# Altium project New PCB Design.PrjPcb
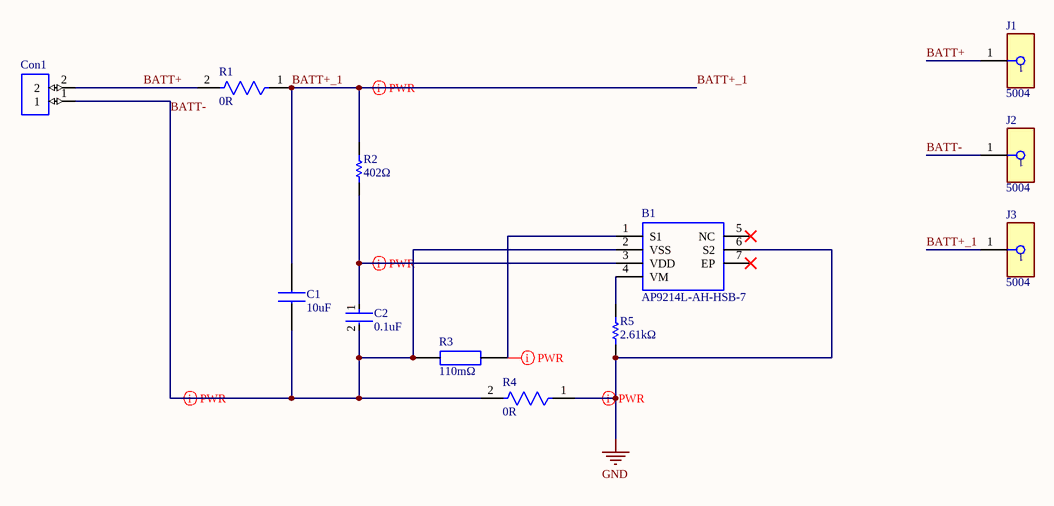
[diagram p0: Battery_Prtection.SchDoc]
3 sheets, 36 parts. Net scope: global (net labels, ports and power ports of the same name join across sheets).
Board file: New PCB Design.PcbDoc
Sheets:
  Battery_Prtection.SchDoc
  Battery_Charger.SchDoc
  Battery_Monitor.SchDoc

## Sheet Battery_Prtection.SchDoc: Battery Protection
size A4; CompanyName: TechLabs Global Pvt Ltd; Organization: TechLabs Global Pvt Ltd; DocumentNumber: 1; Revision: 1.0; SheetNumber: 1; SheetTotal: 3

### Parts
B1  AP9214L-AH-HSB-7  [AP9214LAHHSB7]
C1  10uF  [CAPC1005X70N]
C2  0.1uF  [FP-CC0402-MFG]
Con1  SM02B-SRSS-TB(LF)(SN)  [SM02B-SRSS-TB(LF)(SN)]  (value not drawn)
J1  5004  [FP-5004-MFG]
J2  5004  [FP-5004-MFG]
J3  5004  [FP-5004-MFG]
R1  0R  [FP-RC0402-0_4-IPC_A]
R2  402Ω  [RESC1005X40X25LL05T10]
R3  110mΩ  [RESC6432X65N]
R4  0R  [FP-RC0402-0_4-IPC_A]
R5  2.61kΩ  [RESC1005X40X25NL05T10]

### Nets
GND: B1.6(S2) R4.1 R5.1
BATT+: Con1.2 J1.1 R1.2
BATT+_1: C1.2 J3.1 R1.1 R2.2
BATT-: B1.2(VSS) C1.1 C2.2 Con1.1 J2.1 R3.1 R4.2
NetB1_1: B1.1(S1) R3.2
NetB1_3: B1.3(VDD) C2.1 R2.1
NetB1_4: B1.4(VM) R5.2

Not connected (* = marked no-connect by the designer): B1 5(NC)* 7(EP)*

### Layout directives
rule Width Constraint [Pref Width = 20mil    Min Width = 12mil    Max Width = 36mil]: BATT+_1, BATT-, GND, NetB1_1, NetB1_3

### Notes on the sheet
- Title
- Size:
- Date:
- A4
- Number:
- Time:
- Revision:
- Sheet
- of
- File:

### Library data of the parts
B1 = AP9214L-AH-HSB-7: Battery Management Sgl Chip Sol 1-Cell 30V Li Battery Mgt; Manufacturer: Diodes Inc.; Geometry.Height: 0.6mm; Mfr. Part #: AP9214L-AH-HSB-7; Mouser Part Number: 621-AP9214L-AH-HSB-7; Mouser Price/Stock: https://www.mouser.co.uk/ProductDetail/Diodes-Incorporated/AP9214L-AH-HSB-7?qs=QGmEbV89MVMVPmL%2Fj7c%2FKQ%3D%3D; Arrow Part Number: AP9214L-AH-HSB-7; Arrow Price/Stock: https://www.arrow.com/en/products/ap9214l-ah-hsb-7/diodes-incorporated; Mouser Testing Part Number: *; Mouser Testing Price/Stock: *; Datasheet Link: https://www.diodes.com/assets/Datasheets/AP9214L.pdf; Digi-Key Part #: AP9214L-AH-HSB-7DITR-ND,AP9214L-AH-HSB-7DICT-ND,AP9214L-AH-HSB-7DIDKR-ND; Package: U-DFN2535-6
C1 = CL05A106MQ5NUNC: CAP CER 10UF 6.3V X5R 0402; Manufacturer: Samsung Electro-Mechanics; Geometry.Height: 0.7mm; Mfr. Part #: CL05A106MQ5NUNC; Mouser Part Number: 187-CL05A106MQ5NUNC; Mouser Price/Stock: https://www.mouser.co.uk/ProductDetail/Samsung-Electro-Mechanics/CL05A106MQ5NUNC?qs=X6jEic%2FHinDK8vVLi1zwpw%3D%3D; Arrow Part Number: CL05A106MQ5NUNC; Arrow Price/Stock: https://www.arrow.com/en/products/cl05a106mq5nunc/samsung-electro-mechanics?region=nac; Datasheet Link: https://datasheet.datasheetarchive.com/originals/distributors/Datasheets-DGA10/2406160.pdf; LCSC Part #: C15525; Package: 0402; Value: 10uF; Digi-Key Part #: 1276-1451-2-ND
C2 = CMP-03422-000773-1: CAP CER 0.1UF 16V X5R 0402; Mfr. Part #: CC0402KRX5R7BB104; Manufacturer: YAGEO; Capacitance: 100 nF; Automotive Grade: NA; Temperature Coefficient: 30ppm/°C; Tolerance: 0.1; Material: Ceramic; Footprint Url: http://www.yageo.com/exep/pages/download/literatures/UPY-C_GEN_24.pdf; ComponentLink2Description: Datasheet; Digikey Description: CAP CER 0.1UF 16V X5R 0402; ComponentLink2URL: http://www.yageo.com/documents/recent/UPY-GP_NP0_16V-to-50V_16.pdf; Device Class L1: Passive Components; Temperature Range High: +125°C; Temperature Range Low: -55°C; Temperature: -55°C to +125°C; Temperature Characteristic: X5R; Octopart: https://octopart.com/cc0402krx5r7bb104-yageo-8376508; Device Class L2: Capacitors; Value: 0.1uF; Voltage Rating: 16 V; Automotive: No; Lead Free: Yes; Height: 0.55mm; Device Class L3: Ceramic Capacitors; Package: CC0402; Mouser Description: Multilayer Ceramic Capacitors MLCC - SMD/SMT 100nF 16V X5R 10%; Ipc Land Pattern Name: CAPC10050X50; RoHS: TRUE; Category: Cap; LCSC Part #: C106204; Digi-Key Part #: 311-1347-2-ND
Con1 = SM02B-SRSS-TB(LF)(SN): Connector Header Surface Mount, Right Angle 2 position 0.039 _1.00mm_; Manufacturer: JST Sales America; MP: SM02B-SRSS-TB_LF__SN_; MF: JST Sales; SnapEDA_Link: https://www.snapeda.com/parts/SM02B-SRSS-TB%28LF%29%28SN%29/JST%20Sales%20America%20Inc./view-part/447499/?ref=snap; Price: None; Value: *; Availability: Unavailable; Package: None; Digi-Key Part #: 455-1802-1-ND; LCSC Part #: C160402; Mfr. Part #: SM02B-SRSS-TB(LF)(SN); Parameter 2: *
J1-J3 = CMP-2000-05575-2: PC TEST POINT MINIATURE YELLOW; Manufacturer: Keystone; Number Of Contacts: 1; Is Female: yes; Device Class L1: Connectors; Mfr. Part #: 5004; Digikey Description: PC TEST POINT MINIATURE YELLOW; ComponentLink2URL: https://www.keyelco.com/product-pdf.cfm?p=1313; Lead Free: Yes; ComponentLink2Description: Datasheet; Category: Conn; Height: 4.72mm; Octopart: https://octopart.com/5004-keystone-28591; Mouser Description: TEST POINT PC MINI .040"D YELLOW; Device Class L3: unset; Contact Material: Silver; Package: 5004; Automotive: No; Device Class L2: unset; RoHS: TRUE; LCSC Part #: C2906762; Digi-Key Part #: 36-5004-ND
R1 R4 = CMP-2002-07342-2: RES SMD 0 OHM JUMPER 1/16W 0402; Manufacturer: YAGEO; Mfr. Part #: RC0402FR-070RL; Temperature Coefficient: 200ppm/°C; Tolerance: 1%; Power Rating: 62.5mW; Voltage Rating: 50V; Max Power Dissipation: 63mW; Resistance: 0R; Features: Moisture Resistant; Length: 1mm; Case Code (Metric): 1005; Series: RC; RoHS Compliant: Yes; Resistor Type: Thick Film; Height: 0.35mm; Min Operating Temperature: -55°C; Case Code (Imperial): 0402; Number of Terminations: 2; Contact Plating: Tin; Package: 0402; Size Code: 0402; Termination: SMD/SMT; Max Operating Temperature: 155°C; Width: 0.5mm; Mount: Surface Mount; Lead Free: Lead Free; Packaging: Tape and Reel; Radiation Hardening: No; LCSC Part #: C106231; Value: 0R; Digi-Key Part #: 311-0.0LRTR-ND
R2 = CMP-2002-07675-1: 50V -55℃~+155℃ ±1% 402Ω Thick Film Resistors 62.5mW ±100ppm/℃ 0402 Chip Resistor - Surface Mount ROHS; Mfr. Part #: RC0402FR-07402RL; Manufacturer: Yageo; Package: 0402; LCSC Part #: C137984; Value: 402Ω; Digi-Key Part #: YAG3152TR-ND
R3 = RL2512FK-070R11L: 1W ±1% ±600ppm/℃ -55℃~+155℃ 110mΩ 2512 Chip Resistor - Surface Mount ROHS; Manufacturer: YAGEO; Geometry.Height: 0.65mm; Mfr. Part #: RL2512FK-070R11L; Mouser Part Number: 603-RL2512FK-070R11L; Mouser Price/Stock: https://www.mouser.co.uk/ProductDetail/Yageo/RL2512FK-070R11L/?qs=x8mT8l3Qr1Hhdc7K4N9hZA%3D%3D; Arrow Part Number: RL2512FK-070R11L; Arrow Price/Stock: https://www.arrow.com/en/products/rl2512fk-070r11l/yageo; Mouser Testing Part Number: *; Mouser Testing Price/Stock: *; Datasheet Link: https://www.yageo.com/upload/media/product/productsearch/datasheet/rchip/PYu-RL_Group_521_RoHS_L_2.pdf; Package: 2512; Value: 110mΩ; LCSC Part #: C876467; Digi-Key Part #: 311-0.11TTR-ND
R5 = CMP-2002-07573-1: 62.5mW Thick Film Resistors 50V ±100ppm/℃ ±1% -55℃~+155℃ 2.61kΩ 0402 Chip Resistor - Surface Mount ROHS; Manufacturer: Yageo / Phycomp; Mfr. Part #: RC0402FR-072K61L; LCSC Part #: C163472; Package: 0402; Value: 2.61kΩ; Tolerance: ±1%; Digi-Key Part #: YAG3103TR-ND

## Sheet Battery_Charger.SchDoc: Battery Charger and Power Management
size A4; Organization: TechLabs Global Pvt Ltd; DocumentNumber: 2; Revision: 1.0; SheetNumber: 2; SheetTotal: 3
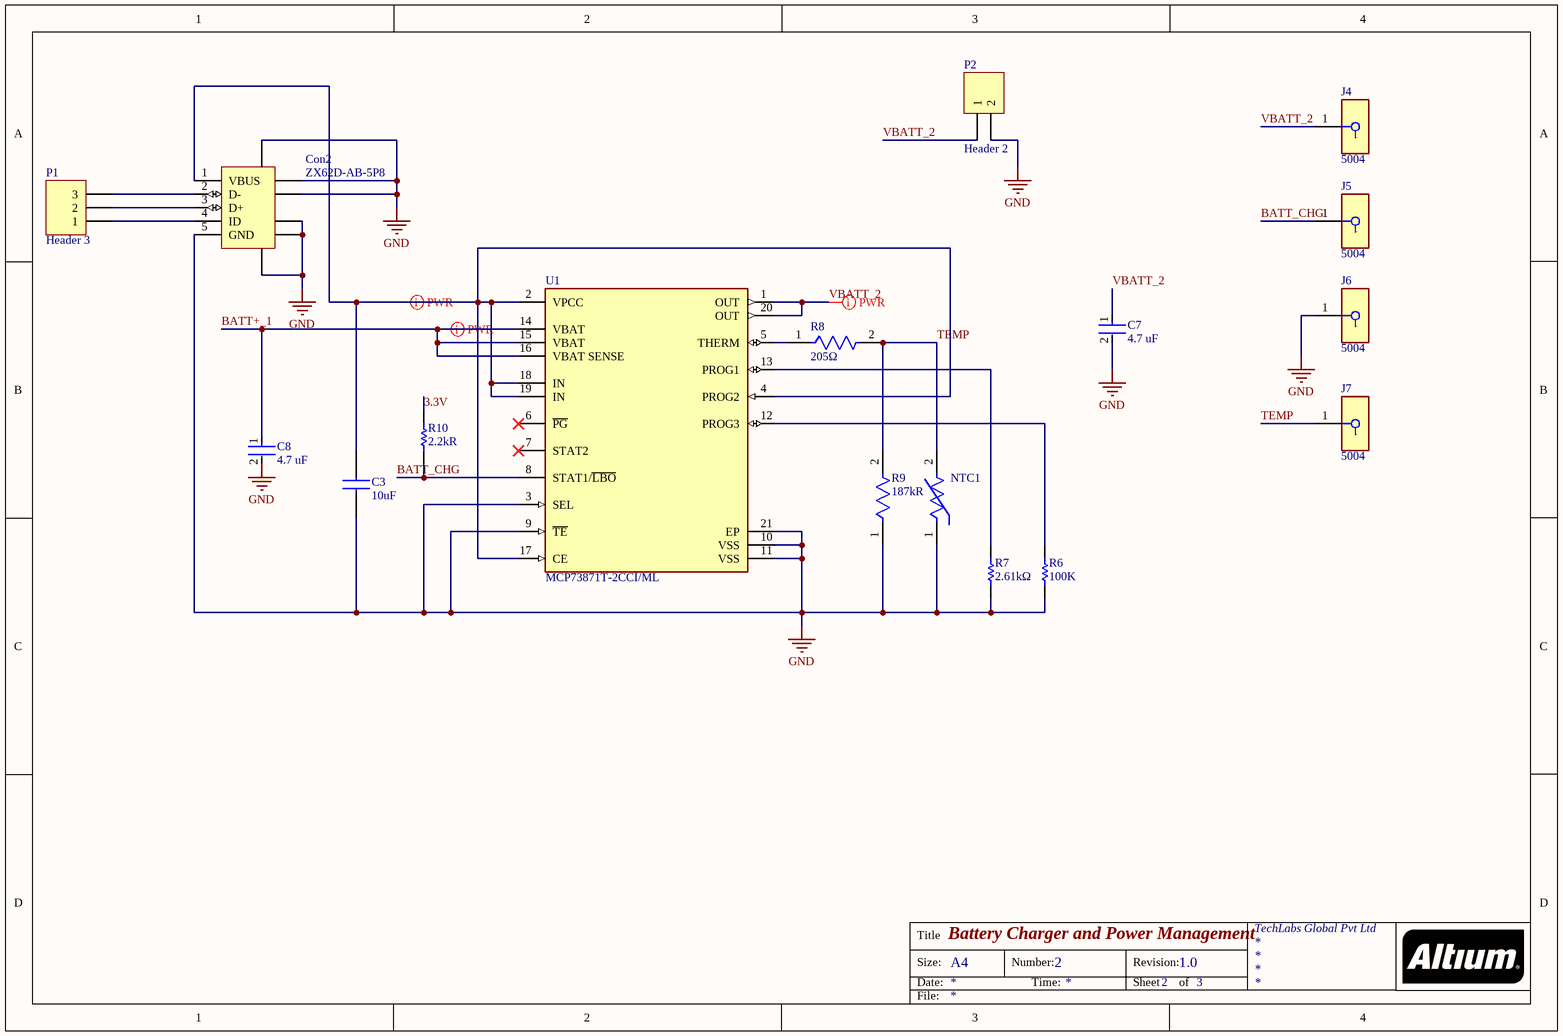
[diagram p1: Battery_Charger.SchDoc]

### Parts
C3  10uF  [CAPC1005X70N]
C7  4.7 uF  [FP-CC0402-MFG]
C8  4.7 uF  [FP-CC0402-MFG]
Con2  ZX62D-AB-5P8  [HIRO-ZX62D-AB-5P8_V]
J4  5004  [FP-5004-MFG]
J5  5004  [FP-5004-MFG]
J6  5004  [FP-5004-MFG]
J7  5004  [FP-5004-MFG]
NTC1  NTC 10K Radial Leaded  [FP-NXR_151B030-MFG]  (value not drawn)
P1  Header 3  [HDR1X3]
P2  Header 2  [HDR1X2]
R6  100K  [RESC1005X40X25NL05T10]
R7  2.61kΩ  [RESC1005X40X25NL05T10]
R8  205Ω  [FP-RT0402-MFG]
R9  187kR  [FP-AC0402-MFG]
R10  2.2kR  [RESC1005X40X25ML05T10]
U1  MCP73871T-2CCI/ML  [FP-C04-126-IPC_C]

### Nets
GND: C3.1 C7.2 C8.2 Con2.5(GND) Con2.6(SHLD) Con2.7(SHLD) Con2.8(SHLD) Con2.9(SHLD) Con2.10(SHLD) Con2.11(SHLD) J6.1 NTC1.1 P2.2 R6.1 R7.1 R9.1 U1.3(SEL) U1.9(~{TE}) U1.10(VSS) U1.11(VSS) U1.21(EP)
3.3V: R10.2
BATT+_1: C8.1 U1.14(VBAT) U1.15(VBAT) U1.16(VBAT_SENSE)
BATT_CHG: J5.1 R10.1 U1.8(STAT1/~{LBO})
TEMP: J7.1 NTC1.2 R8.2 R9.2
VBATT_2: C7.1 J4.1 P2.1 U1.1(OUT) U1.20(OUT)
NetC3_2: C3.2 Con2.1(VBUS) U1.2(VPCC) U1.4(PROG2) U1.17(CE) U1.18(IN) U1.19(IN)
NetCon2_2: Con2.2(D-) P1.3
NetCon2_3: Con2.3(D+) P1.2
NetCon2_4: Con2.4(ID) P1.1
NetR6_2: R6.2 U1.12(PROG3)
NetR7_2: R7.2 U1.13(PROG1)
NetR8_1: R8.1 U1.5(THERM)

Not connected (* = marked no-connect by the designer): U1 6(~{PG})* 7(STAT2)*

### Layout directives
rule Width Constraint [Pref Width = 20mil    Min Width = 12mil    Max Width = 36mil]: BATT+_1, NetC3_2, VBATT_2

### Notes on the sheet
- Title
- Size:
- Date:
- A4
- Number:
- Time:
- Revision:
- Sheet
- of
- File:

### Library data of the parts
C3 = CL05A106MQ5NUNC: as C1 on sheet Battery_Prtection; Mfr. Part #: CL05A106MQ5NUNC; Mouser Part Number: 187-CL05A106MQ5NUNC; Mouser Price/Stock: https://www.mouser.co.uk/ProductDetail/Samsung-Electro-Mechanics/CL05A106MQ5NUNC?qs=X6jEic%2FHinDK8vVLi1zwpw%3D%3D; Arrow Part Number: CL05A106MQ5NUNC; Arrow Price/Stock: https://www.arrow.com/en/products/cl05a106mq5nunc/samsung-electro-mechanics?region=nac; Datasheet Link: https://datasheet.datasheetarchive.com/originals/distributors/Datasheets-DGA10/2406160.pdf; LCSC Part #: C15525; Package: 0402; Value: 10uF; Digi-Key Part #: 1276-1451-2-ND
C7 C8 = CMP-1034-02137-2: CAP CER 4.7UF 6.3V X5R 0402; Manufacturer: YAGEO; Mfr. Part #: CC0402MRX5R5BB475; Temperature Coefficient: 30ppm/°C; Tolerance: 0.2; Automotive Grade: NA; Material: Ceramic; Automotive: No; Temperature: -55°C to +125°C; Category: Cap; Ipc Land Pattern Name: CAPC10050X50; Digikey Description: CAP CER 4.7UF 6.3V X5R 0402; ComponentLink2Description: Datasheet; Octopart: https://octopart.com/cc0402mrx5r5bb475-yageo-20021081; Mouser Description: Multilayer Ceramic Capacitors MLCC - SMD/SMT 4.7uF 6.3V X5R 20%; Device Class L1: Passive Components; Footprint Url: http://www.yageo.com/exep/pages/download/literatures/UPY-C_GEN_24.pdf; Value: 4.7 uF; Temperature Range High: +125°C; ComponentLink2URL: http://www.yageo.com/documents/recent/UPY-GP_NP0_16V-to-50V_16.pdf; Voltage Rating: 6.3 V; Height: 0.55mm; RoHS: TRUE; Package: CC0402; Device Class L3: Ceramic Capacitors; Temperature Characteristic: X5R; Temperature Range Low: -55°C; Capacitance: 4.7 uF; Device Class L2: Capacitors; Lead Free: Yes; LCSC Part #: C106859; Digi-Key Part #: 311-1730-2-ND
Con2 = CMP-1349-00001-2: USB 2.0 Standard Micro-USB Connector, Micro AB-Standard (Bottom Mount), 30 V AC, -30 to 85 degC, Right Angle, 5-Pin 7.5 x 5.6 x 2.8 mm SMD, RoHS, Reel; Mfr. Part #: ZX62D-AB-5P8(30); Manufacturer: Hirose Electric; Number of Contacts: 5; Capacitance: 2 pF Max.; Voltage Rating: 30 V AC; Contact Resistance: 30 mOhm Max.; Mounting Technology: Surface Mount; ComponentLink1URL: http://www.hirose.com/; ComponentLink2URL: http://www.hirose.co.jp/cataloge_hp/ed_ZX_20140804.pdf; ComponentLink1Description: Manufacturer URL; ComponentLink3Description: Package Specification; Operating Temperature Range: -30 to 85 degC; RoHS: TRUE; DatasheetVersion: Aug-14; PackageDescription: USB Micro-AB Connector, Right Angle, Body 7.5 x 5.6 mm, Pitch 0.65 mm, Height 2.8 mm; ComponentLink3URL: http://www.hirose.co.jp/cataloge_hp/ed_ZX_20140804.pdf; Packing: Reel; ComponentLink2Description: Datasheet; LCSC Part #: C598206; Package: SMD; Digi-Key Part #: H125271TR-ND
J4-J7 = CMP-2000-05575-2: as J1 on sheet Battery_Prtection; Device Class L1: Connectors; Mfr. Part #: 5004; Digikey Description: PC TEST POINT MINIATURE YELLOW; ComponentLink2URL: https://www.keyelco.com/product-pdf.cfm?p=1313; Lead Free: Yes; ComponentLink2Description: Datasheet; Category: Conn; Height: 4.72mm; Octopart: https://octopart.com/5004-keystone-28591; Mouser Description: TEST POINT PC MINI .040"D YELLOW; Device Class L3: unset; Contact Material: Silver; Package: 5004; Automotive: No; Device Class L2: unset; RoHS: TRUE; LCSC Part #: C2906762; Digi-Key Part #: 36-5004-ND
NTC1 = CMP-06022-001050-1: NTC Thermistors ±1% 7.5mW 3380K ±1% 10kΩ Radial Leaded NTC Thermistors ROHS; Manufacturer: Murata Electronics; Mfr. Part #: NXRT15XH103FA1B030; Resistance: 10kR; Lead Diameter: 0.4mm; RoHS Compliant: Yes; Number of Pins: 2; Lead Free: Lead Free; Max Power Dissipation: 7.5mW; Height: 2mm; Lead Pitch: 2.5mm; Power Rating: 7.5mW; Series: NXR; Packaging: Bulk; Package Quantity: 500; Width: 4mm; Max Operating Temperature: 125°C; Termination: Radial; Min Operating Temperature: -40°C; Tolerance: 1%; Resistance Tolerance: 1%; Length: 5mm; Mount: Through Hole; B-Constant: 3380K; LCSC Part #: C152559; Datasheet: https://datasheet.lcsc.com/lcsc/1810170223_Murata-Electronics-NXRT15XH103FA1B030_C152559.pdf; Resistance in Ohms @ 25°C: 10K; Digi-Key Part #: 490-8601-ND
P1 = Header 3: Header, 3-Pin; LatestRevisionDate: 17-Jul-2002; LatestRevisionNote: Re-released for DXP Platform.; Publisher: Altium Limited
P2 = Header 2: Header, 2-Pin; LatestRevisionDate: 17-Jul-2002; LatestRevisionNote: Re-released for DXP Platform.; Publisher: Altium Limited
R6 = CMP-2002-07343-1: 100K ±1% 1/16W 0402 Chip Resistor - Surface Mount RoHS; Manufacturer: Yageo / Phycomp; Mfr. Part #: RC0402FR-07100KL; Resistance: 100K; LCSC Part #: Tolerance; Package: 0402; Power (Watts): 1/16W; Tolerance: ±1%; Digi-Key Part #: 311-100KLRTR-ND
R7 = CMP-2002-07573-1: as R5 on sheet Battery_Prtection; LCSC Part #: C163472; Package: 0402; Value: 2.61kΩ; Tolerance: ±1%; Digi-Key Part #: YAG3103TR-ND
R8 = CMP-03412-026788-1: 205Ω 50V ±50ppm/℃ -55℃~+155℃ ±1% Thin Film Resistor 62.5mW 0402 Chip Resistor - Surface Mount ROHS; Mfr. Part #: RT0402FRE07205RL; Manufacturer: Yageo; Tolerance: 0.01; Power Rating: 0.063W; Temperature Coefficient: 50 ppm/°C; Temperature: -55°C to +155°C; Category: Res; ComponentLink2URL: http://www.yageo.com/documents/recent/PYu-RT_1-to-0.01_RoHS_L_9.pdf; Footprint Url: http://www.yageo.com/exep/pages/download/literatures/PYu-R_Mount_10.pdf; Octopart: https://octopart.com/rt0402fre07205rl-yageo-1208039; Device Class L3: Chip SMD Resistors; Device Class L1: Passive Components; Device Class L2: Resistors; Lead Free: Yes; Package: RT0402; Automotive: No; Series: RT; Composition: Thin Film; Value: 205Ω; Digikey Description: RES SMD 205 OHM 1% 1/16W 0402; Voltage Rating: 50V; Temperature Range High: +155°C; ComponentLink2Description: Datasheet; Ipc Land Pattern Name: RESC10050X30; Temperature Range Low: -55°C; RoHS: TRUE; Height: 0.35mm; Resistance: 205Ω; LCSC Part #: C327014; Digi-Key Part #: RT0402FRE07205RL-ND
R9 = CMP-03412-002180-2: 187kΩ ±1% -55℃~+155℃ 50V Thick Film Resistors 62.5mW ±100ppm/℃ 0402 Chip Resistor - Surface Mount ROHS; Manufacturer: YAGEO; Mfr. Part #: AC0402FR-07187KL; Max Power Dissipation: 63mW; Temperature Coefficient: 100ppm/°C; Series: AC; Tolerance: 1%; Resistor Type: Thick Film; Features: Moisture Resistant; Resistance: 187kR; RoHS Compliant: Yes; Length: 0.039inch; Width: 0.02inch; Height: 0.015inch; Number of Terminations: 2; Min Operating Temperature: -55°C; Package: 0402; Max Operating Temperature: 155°C; Packaging: Tape and Reel; Value: 187kR; LCSC Part #: C226824; Digi-Key Part #: 13-AC0402FR-07187KLTR-ND
R10 = CMP-2002-07567-1: 62.5mW Thick Film Resistors 50V ±100ppm/℃ ±1% -55℃~+155℃ 2.2kΩ 0402 Chip Resistor - Surface Mount ROHS; Manufacturer: Yageo / Phycomp; Mfr. Part #: RC0402FR-072K2L; Power (Watts): 63mW; LCSC Part #: C114762; Package: 0402; Tolerance: 1%; Value: 2.2kR; Digi-Key Part #: 311-2.20KLRTR-ND
U1 = CMP-06318-000014-1: IC USB/AC BATT CHRGR W/PPM 20QFN; Manufacturer: Microchip Technology; Mfr. Part # (Alternative): MCP73871-2CCI/ML; Min Supply Voltage: 4.5V; Output Current: 1A; Output Voltage: 4.2V; Max Supply Voltage: 6V; Case/Package: QFN; RoHS Compliant: Yes; Min Operating Temperature: -40°C; Mount: Surface Mount; Package Quantity: 3300; Packaging: Tape and Reel; Number of Pins: 20; Max Operating Temperature: 85°C; Lead Free: Lead Free; Contact Plating: Tin; Mfr. Part #: MCP73871T-2CCI/ML; Package: QFN-20(4x4); Digi-Key Part #: MCP73871T-2CCI/MLTR-ND

## Sheet Battery_Monitor.SchDoc: Battery Monitor
size A4; Organization: TechLabs Global Pvt Ltd; DocumentNumber: 3; Revision: 1.0; SheetNumber: 3; SheetTotal: 3
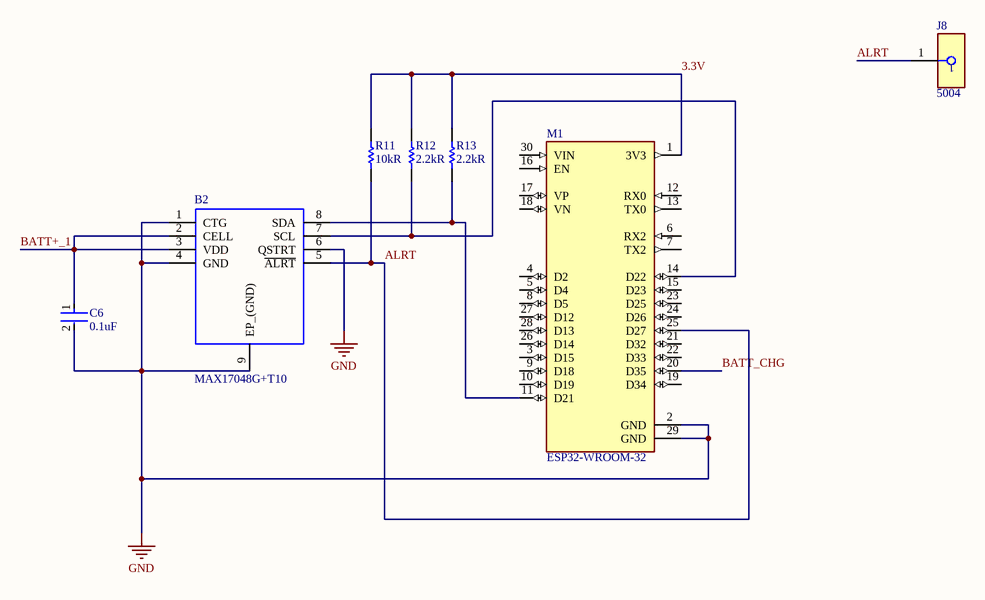
[diagram p2: Battery_Monitor.SchDoc]

### Parts
B2  MAX17048G+T10  [SON50P200X200X80-9N-D]
C6  0.1uF  [FP-CC0402-MFG]
J8  5004  [FP-5004-MFG]
M1  ESP32-WROOM-32  [ESP32-DEVKIT-V1]
R11  10kR  [RESC1005X40X25LL05T10]
R12  2.2kR  [RESC1005X40X25ML05T10]
R13  2.2kR  [RESC1005X40X25ML05T10]

### Nets
GND: B2.1(CTG) B2.4(GND) B2.6(QSTRT) B2.9(EP_(GND)) C6.2 M1.2(GND) M1.29(GND)
3.3V: M1.1(3V3) R11.2 R12.2 R13.2
ALRT: B2.5(~{ALRT}) J8.1 M1.25(D27) R11.1
BATT+_1: B2.2(CELL) B2.3(VDD) C6.1
BATT_CHG: M1.20(D35)
NetB2_7: B2.7(SCL) M1.14(D22) R12.1
NetB2_8: B2.8(SDA) M1.11(D21) R13.1

Not connected (* = marked no-connect by the designer): M1 3(D15) 4(D2) 5(D4) 6(RX2) 7(TX2) 8(D5) 9(D18) 10(D19) 12(RX0) 13(TX0) 15(D23) 16(EN) 17(VP) 18(VN) 19(D34) 21(D32) 22(D33) 23(D25) 24(D26) 26(D14) 27(D12) 28(D13) 30(VIN)

### Notes on the sheet
- Title
- Size:
- Date:
- A4
- Number:
- Time:
- Revision:
- Sheet
- of
- File:

### Library data of the parts
B2 = MAX17048G+T10: Battery Management Host-Side Modelgauge (1-Cell); Manufacturer: Maxim Integrated; Geometry.Height: 0.8mm; Mfr. Part #: MAX17048G+T10; Mouser Part Number: 700-MAX17048G+T10; Mouser Price/Stock: https://www.mouser.co.uk/ProductDetail/Maxim-Integrated/MAX17048G%2bT10?qs=D7PJwyCwLAoGnnn8jEPRBQ%3D%3D; Arrow Part Number: MAX17048G+T10; Arrow Price/Stock: https://www.arrow.com/en/products/max17048gt10/maxim-integrated?region=nac; Mouser Testing Part Number: *; Mouser Testing Price/Stock: *; Datasheet Link: https://datasheets.maximintegrated.com/en/ds/MAX17048-MAX17049.pdf; LCSC Part #: C2682616; Package: TDFN-8_EP; Digi-Key Part #: MAX17048G+T10TR-ND
C6 = CMP-03422-000773-1: as C2 on sheet Battery_Prtection; Footprint Url: http://www.yageo.com/exep/pages/download/literatures/UPY-C_GEN_24.pdf; ComponentLink2Description: Datasheet; Digikey Description: CAP CER 0.1UF 16V X5R 0402; ComponentLink2URL: http://www.yageo.com/documents/recent/UPY-GP_NP0_16V-to-50V_16.pdf; Device Class L1: Passive Components; Temperature Range High: +125°C; Temperature Range Low: -55°C; Temperature: -55°C to +125°C; Temperature Characteristic: X5R; Octopart: https://octopart.com/cc0402krx5r7bb104-yageo-8376508; Device Class L2: Capacitors; Value: 0.1uF; Voltage Rating: 16 V; Automotive: No; Lead Free: Yes; Height: 0.55mm; Device Class L3: Ceramic Capacitors; Package: CC0402; Mouser Description: Multilayer Ceramic Capacitors MLCC - SMD/SMT 100nF 16V X5R 10%; Ipc Land Pattern Name: CAPC10050X50; RoHS: TRUE; Category: Cap; LCSC Part #: C106204; Digi-Key Part #: 311-1347-2-ND
J8 = CMP-2000-05575-2: as J1 on sheet Battery_Prtection; Device Class L1: Connectors; Mfr. Part #: 5004; Digikey Description: PC TEST POINT MINIATURE YELLOW; ComponentLink2URL: https://www.keyelco.com/product-pdf.cfm?p=1313; Lead Free: Yes; ComponentLink2Description: Datasheet; Category: Conn; Height: 4.72mm; Octopart: https://octopart.com/5004-keystone-28591; Mouser Description: TEST POINT PC MINI .040"D YELLOW; Device Class L3: unset; Contact Material: Silver; Package: 5004; Automotive: No; Device Class L2: unset; RoHS: TRUE; LCSC Part #: C2906762; Digi-Key Part #: 36-5004-ND
M1 = ESP32-DEVKIT-V1: Dual core, Wi-Fi: 2.4 GHz up to 150 Mbits/s,BLE (Bluetooth Low Energy) and legacy Bluetooth, 32 bits, Up to 240 MHz
R11 = CMP-2002-07353-1: 50V 10kΩ Thick Film Resistors 62.5mW ±1% -55℃~+155℃ ±100ppm/℃ 0402 Chip Resistor - Surface Mount ROHS; Mfr. Part #: RC0402FR-0710KL; Manufacturer: Yageo / Phycomp; LCSC Part #: C60490; Package: 0402; Power (Watts): 62.5mW; Tolerance: 1%; Value: 10kR; Digi-Key Part #: 311-10.0KLRTR-ND
R12 R13 = CMP-2002-07567-1: as R10 on sheet Battery_Charger; LCSC Part #: C114762; Package: 0402; Tolerance: 1%; Value: 2.2kR; Digi-Key Part #: 311-2.20KLRTR-ND

## Nets that join several sheets
GND: Battery_Prtection (B1.6 R4.1 R5.1), Battery_Charger (21 pins), Battery_Monitor (7 pins)
3.3V: Battery_Charger (R10.2), Battery_Monitor (M1.1 R11.2 R12.2 R13.2)
BATT+_1: Battery_Prtection (C1.2 J3.1 R1.1 R2.2), Battery_Charger (C8.1 U1.14 U1.15 U1.16), Battery_Monitor (B2.2 B2.3 C6.1)
BATT_CHG: Battery_Charger (J5.1 R10.1 U1.8), Battery_Monitor (M1.20)